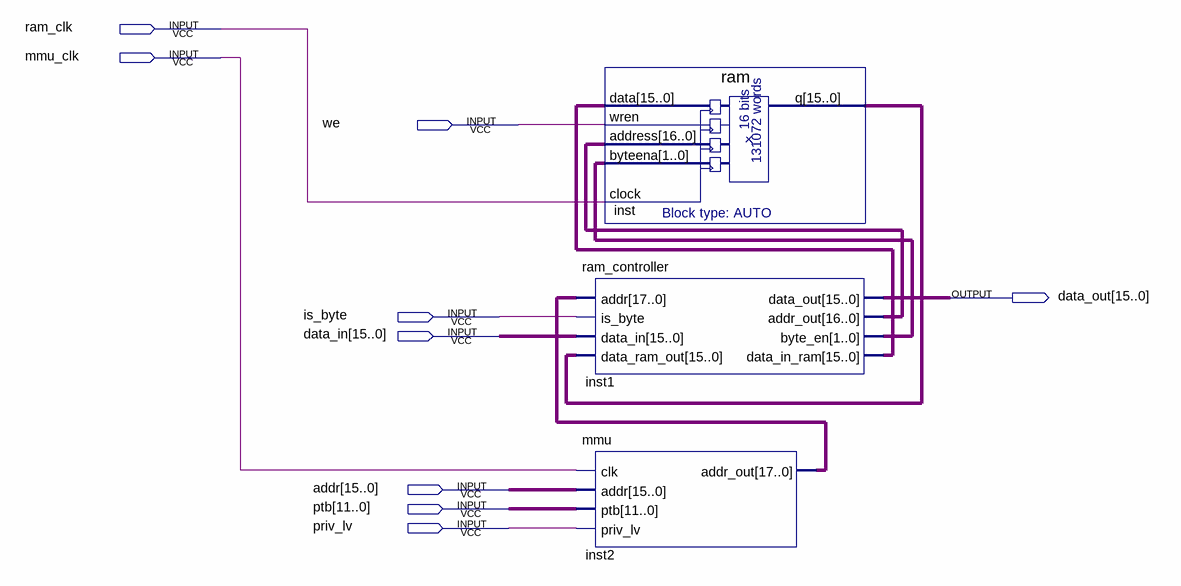
[diagram p0: schematic sheet]
// Quartus schematic mem.bdf as structural Verilog: 3 symbols, 9 pins
module mem (
  input  ram_clk,
  input  mmu_clk,
  input  we,
  input  is_byte,
  input  [15:0] data_in,
  input  [15:0] addr,
  input  [11:0] ptb,
  input  priv_lv,
  output [15:0] data_out
);

  wire [1:0] inst1_byte_en;
  wire [15:0] inst1_data_in_ram, inst_q;
  wire [16:0] inst1_addr_out;
  wire [17:0] inst2_addr_out;

  ram inst (
    .data(inst1_data_in_ram), .wren(we), .address(inst1_addr_out), .byteena(inst1_byte_en), .clock(ram_clk),
    .q(inst_q));
  ram_controller inst1 (
    .addr(inst2_addr_out), .is_byte(is_byte), .data_in(data_in), .data_ram_out(inst_q), .data_out(data_out),
    .addr_out(inst1_addr_out), .byte_en(inst1_byte_en), .data_in_ram(inst1_data_in_ram));
  mmu inst2 (.clk(mmu_clk), .addr(addr), .ptb(ptb), .priv_lv(priv_lv), .addr_out(inst2_addr_out));
endmodule
